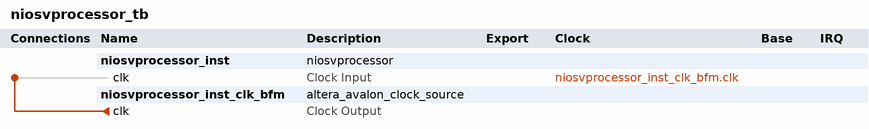
[diagram p0: system contents]
# Platform Designer (Qsys) system niosvprocessor_tb, Cyclone V 5CSEBA6U23I7
# Parameters at their usual value, and those the tool derives, are not listed.
package require -exact qsys 23.1
create_system niosvprocessor_tb
set_project_property DEVICE_FAMILY {Cyclone V}
set_project_property DEVICE 5CSEBA6U23I7

add_instance niosvprocessor_inst niosvprocessor 1.0

add_instance niosvprocessor_inst_clk_bfm altera_avalon_clock_source 23.1

# connections
add_connection niosvprocessor_inst_clk_bfm.clk niosvprocessor_inst.clk clock

set_interconnect_requirement {$system} qsys_mm.clockCrossingAdapter HANDSHAKE
set_interconnect_requirement {$system} qsys_mm.enableEccProtection FALSE
set_interconnect_requirement {$system} qsys_mm.insertDefaultSlave FALSE
set_interconnect_requirement {$system} qsys_mm.maxAdditionalLatency 1

save_system niosvprocessor_tb.qsys
